# Altium project RetroClock-PCBMAIN.PrjPcb (part 2 of 2)
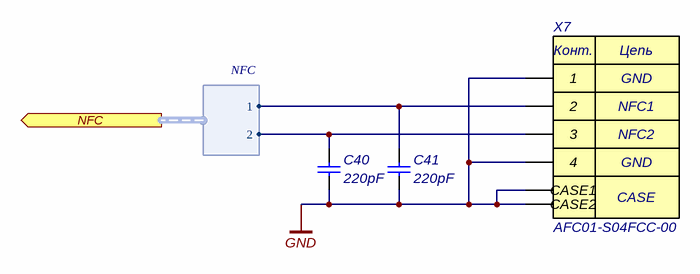
[diagram p9: RF-CON-NFC.SchDoc]

## Nets that join several sheets
GND: Board (42 pins), MCU (8 pins), I2C-LX (C27.1 C28.1 D3.3), I2C-RTC (6 pins), NIXIE-CTRL (31 pins), NIXIE-CTRL/EXPANDER (C25_NIXIE-CTRL_EXPANDER#1.1 C26_NIXIE-CTRL_EXPANDER#1.1 D2_NIXIE-CTRL_EXPANDER#1.9 D2_NIXIE-CTRL_EXPANDER#1.PAD), NIXIE-CTRL (31 pins), NIXIE-CTRL/EXPANDER (C25_NIXIE-CTRL_EXPANDER#2.1 C26_NIXIE-CTRL_EXPANDER#2.1 D2_NIXIE-CTRL_EXPANDER#2.9 D2_NIXIE-CTRL_EXPANDER#2.PAD), NIXIE-CTRL (31 pins), NIXIE-CTRL/EXPANDER (C25_NIXIE-CTRL_EXPANDER#3.1 C26_NIXIE-CTRL_EXPANDER#3.1 D2_NIXIE-CTRL_EXPANDER#3.9 D2_NIXIE-CTRL_EXPANDER#3.PAD), NIXIE-CTRL (31 pins), NIXIE-CTRL/EXPANDER (C25_NIXIE-CTRL_EXPANDER#4.1 C26_NIXIE-CTRL_EXPANDER#4.1 D2_NIXIE-CTRL_EXPANDER#4.9 D2_NIXIE-CTRL_EXPANDER#4.PAD), PWM-DCBOOST-NIXIE (10 pins), RF-PCBF-2G4 (C38.1 C39.1 W1.2), RF-CON-NFC (6 pins)
VDD-DIGITAL: Board (23 pins), I2C-LX (C27.2 C28.2 D3.1), NIXIE-CTRL (5 pins), NIXIE-CTRL/EXPANDER (C25_NIXIE-CTRL_EXPANDER#1.2 C26_NIXIE-CTRL_EXPANDER#1.2 D2_NIXIE-CTRL_EXPANDER#1.21 R27_NIXIE-CTRL_EXPANDER#1.2), NIXIE-CTRL (5 pins), NIXIE-CTRL/EXPANDER (C25_NIXIE-CTRL_EXPANDER#2.2 C26_NIXIE-CTRL_EXPANDER#2.2 D2_NIXIE-CTRL_EXPANDER#2.21 R27_NIXIE-CTRL_EXPANDER#2.2), NIXIE-CTRL (5 pins), NIXIE-CTRL/EXPANDER (C25_NIXIE-CTRL_EXPANDER#3.2 C26_NIXIE-CTRL_EXPANDER#3.2 D2_NIXIE-CTRL_EXPANDER#3.21 R27_NIXIE-CTRL_EXPANDER#3.2), NIXIE-CTRL (5 pins), NIXIE-CTRL/EXPANDER (C25_NIXIE-CTRL_EXPANDER#4.2 C26_NIXIE-CTRL_EXPANDER#4.2 D2_NIXIE-CTRL_EXPANDER#4.21 R27_NIXIE-CTRL_EXPANDER#4.2)
VDD-NIXIE: NIXIE-CTRL (R28_NIXIE-CTRL#1.1 VT1_NIXIE-CTRL#1.2), NIXIE-CTRL (R28_NIXIE-CTRL#2.1 VT1_NIXIE-CTRL#2.2), NIXIE-CTRL (R28_NIXIE-CTRL#3.1 VT1_NIXIE-CTRL#3.2), NIXIE-CTRL (R28_NIXIE-CTRL#4.1 VT1_NIXIE-CTRL#4.2), PWM-DCBOOST-NIXIE (C33.1 C34.1 R76.1 VD1.1)
VDD-RTC: Board (VD2.1 VD3.1), I2C-RTC (C29.1 C30.1 D4.12)
VDD-VBUS: Board (14 pins), PWM-DCBOOST-NIXIE (C35.1 C37.1 D5.4 L4.1)
A0: NIXIE-CTRL (R56_NIXIE-CTRL#1.1 R61_NIXIE-CTRL#1.2), NIXIE-CTRL/EXPANDER (D2_NIXIE-CTRL_EXPANDER#1.18)
A0: NIXIE-CTRL (R56_NIXIE-CTRL#2.1 R61_NIXIE-CTRL#2.2), NIXIE-CTRL/EXPANDER (D2_NIXIE-CTRL_EXPANDER#2.18)
A0: NIXIE-CTRL (R56_NIXIE-CTRL#3.1 R61_NIXIE-CTRL#3.2), NIXIE-CTRL/EXPANDER (D2_NIXIE-CTRL_EXPANDER#3.18)
A0: NIXIE-CTRL (R56_NIXIE-CTRL#4.1 R61_NIXIE-CTRL#4.2), NIXIE-CTRL/EXPANDER (D2_NIXIE-CTRL_EXPANDER#4.18)
A1: NIXIE-CTRL (R57_NIXIE-CTRL#1.1 R62_NIXIE-CTRL#1.2), NIXIE-CTRL/EXPANDER (D2_NIXIE-CTRL_EXPANDER#1.23)
A1: NIXIE-CTRL (R57_NIXIE-CTRL#2.1 R62_NIXIE-CTRL#2.2), NIXIE-CTRL/EXPANDER (D2_NIXIE-CTRL_EXPANDER#2.23)
A1: NIXIE-CTRL (R57_NIXIE-CTRL#3.1 R62_NIXIE-CTRL#3.2), NIXIE-CTRL/EXPANDER (D2_NIXIE-CTRL_EXPANDER#3.23)
A1: NIXIE-CTRL (R57_NIXIE-CTRL#4.1 R62_NIXIE-CTRL#4.2), NIXIE-CTRL/EXPANDER (D2_NIXIE-CTRL_EXPANDER#4.23)
A2: NIXIE-CTRL (R58_NIXIE-CTRL#1.1 R63_NIXIE-CTRL#1.2), NIXIE-CTRL/EXPANDER (D2_NIXIE-CTRL_EXPANDER#1.24)
A2: NIXIE-CTRL (R58_NIXIE-CTRL#2.1 R63_NIXIE-CTRL#2.2), NIXIE-CTRL/EXPANDER (D2_NIXIE-CTRL_EXPANDER#2.24)
A2: NIXIE-CTRL (R58_NIXIE-CTRL#3.1 R63_NIXIE-CTRL#3.2), NIXIE-CTRL/EXPANDER (D2_NIXIE-CTRL_EXPANDER#3.24)
A2: NIXIE-CTRL (R58_NIXIE-CTRL#4.1 R63_NIXIE-CTRL#4.2), NIXIE-CTRL/EXPANDER (D2_NIXIE-CTRL_EXPANDER#4.24)
BRD-I2C-SCL: Board (7 pins), I2C-LX (D3.4), I2C-RTC (D4.10), NIXIE-CTRL/EXPANDER (D2_NIXIE-CTRL_EXPANDER#1.19), NIXIE-CTRL/EXPANDER (D2_NIXIE-CTRL_EXPANDER#2.19), NIXIE-CTRL/EXPANDER (D2_NIXIE-CTRL_EXPANDER#3.19), NIXIE-CTRL/EXPANDER (D2_NIXIE-CTRL_EXPANDER#4.19)
BRD-I2C-SDA: Board (7 pins), I2C-LX (D3.6), I2C-RTC (D4.9), NIXIE-CTRL/EXPANDER (D2_NIXIE-CTRL_EXPANDER#1.20), NIXIE-CTRL/EXPANDER (D2_NIXIE-CTRL_EXPANDER#2.20), NIXIE-CTRL/EXPANDER (D2_NIXIE-CTRL_EXPANDER#3.20), NIXIE-CTRL/EXPANDER (D2_NIXIE-CTRL_EXPANDER#4.20)
BRD-NIXIE-INT#: Board (R1.2), NIXIE-CTRL/EXPANDER (D2_NIXIE-CTRL_EXPANDER#1.22 R27_NIXIE-CTRL_EXPANDER#1.1), NIXIE-CTRL/EXPANDER (D2_NIXIE-CTRL_EXPANDER#2.22 R27_NIXIE-CTRL_EXPANDER#2.1), NIXIE-CTRL/EXPANDER (D2_NIXIE-CTRL_EXPANDER#3.22 R27_NIXIE-CTRL_EXPANDER#3.1), NIXIE-CTRL/EXPANDER (D2_NIXIE-CTRL_EXPANDER#4.22 R27_NIXIE-CTRL_EXPANDER#4.1)
P00: NIXIE-CTRL (R54_NIXIE-CTRL#1.1), NIXIE-CTRL/EXPANDER (D2_NIXIE-CTRL_EXPANDER#1.1)
P00: NIXIE-CTRL (R54_NIXIE-CTRL#2.1), NIXIE-CTRL/EXPANDER (D2_NIXIE-CTRL_EXPANDER#2.1)
P00: NIXIE-CTRL (R54_NIXIE-CTRL#3.1), NIXIE-CTRL/EXPANDER (D2_NIXIE-CTRL_EXPANDER#3.1)
P00: NIXIE-CTRL (R54_NIXIE-CTRL#4.1), NIXIE-CTRL/EXPANDER (D2_NIXIE-CTRL_EXPANDER#4.1)
P01: NIXIE-CTRL (R55_NIXIE-CTRL#1.1), NIXIE-CTRL/EXPANDER (D2_NIXIE-CTRL_EXPANDER#1.2)
P01: NIXIE-CTRL (R55_NIXIE-CTRL#2.1), NIXIE-CTRL/EXPANDER (D2_NIXIE-CTRL_EXPANDER#2.2)
P01: NIXIE-CTRL (R55_NIXIE-CTRL#3.1), NIXIE-CTRL/EXPANDER (D2_NIXIE-CTRL_EXPANDER#3.2)
P01: NIXIE-CTRL (R55_NIXIE-CTRL#4.1), NIXIE-CTRL/EXPANDER (D2_NIXIE-CTRL_EXPANDER#4.2)
P03: NIXIE-CTRL (R53_NIXIE-CTRL#1.1), NIXIE-CTRL/EXPANDER (D2_NIXIE-CTRL_EXPANDER#1.4)
P03: NIXIE-CTRL (R53_NIXIE-CTRL#2.1), NIXIE-CTRL/EXPANDER (D2_NIXIE-CTRL_EXPANDER#2.4)
P03: NIXIE-CTRL (R53_NIXIE-CTRL#3.1), NIXIE-CTRL/EXPANDER (D2_NIXIE-CTRL_EXPANDER#3.4)
P03: NIXIE-CTRL (R53_NIXIE-CTRL#4.1), NIXIE-CTRL/EXPANDER (D2_NIXIE-CTRL_EXPANDER#4.4)
P04: NIXIE-CTRL (R52_NIXIE-CTRL#1.1), NIXIE-CTRL/EXPANDER (D2_NIXIE-CTRL_EXPANDER#1.5)
P04: NIXIE-CTRL (R52_NIXIE-CTRL#2.1), NIXIE-CTRL/EXPANDER (D2_NIXIE-CTRL_EXPANDER#2.5)
P04: NIXIE-CTRL (R52_NIXIE-CTRL#3.1), NIXIE-CTRL/EXPANDER (D2_NIXIE-CTRL_EXPANDER#3.5)
P04: NIXIE-CTRL (R52_NIXIE-CTRL#4.1), NIXIE-CTRL/EXPANDER (D2_NIXIE-CTRL_EXPANDER#4.5)
P05: NIXIE-CTRL (R51_NIXIE-CTRL#1.1), NIXIE-CTRL/EXPANDER (D2_NIXIE-CTRL_EXPANDER#1.6)
P05: NIXIE-CTRL (R51_NIXIE-CTRL#2.1), NIXIE-CTRL/EXPANDER (D2_NIXIE-CTRL_EXPANDER#2.6)
P05: NIXIE-CTRL (R51_NIXIE-CTRL#3.1), NIXIE-CTRL/EXPANDER (D2_NIXIE-CTRL_EXPANDER#3.6)
P05: NIXIE-CTRL (R51_NIXIE-CTRL#4.1), NIXIE-CTRL/EXPANDER (D2_NIXIE-CTRL_EXPANDER#4.6)
P06: NIXIE-CTRL (R59_NIXIE-CTRL#1.1), NIXIE-CTRL/EXPANDER (D2_NIXIE-CTRL_EXPANDER#1.7)
P06: NIXIE-CTRL (R59_NIXIE-CTRL#2.1), NIXIE-CTRL/EXPANDER (D2_NIXIE-CTRL_EXPANDER#2.7)
P06: NIXIE-CTRL (R59_NIXIE-CTRL#3.1), NIXIE-CTRL/EXPANDER (D2_NIXIE-CTRL_EXPANDER#3.7)
P06: NIXIE-CTRL (R59_NIXIE-CTRL#4.1), NIXIE-CTRL/EXPANDER (D2_NIXIE-CTRL_EXPANDER#4.7)
P10: NIXIE-CTRL (R50_NIXIE-CTRL#1.1), NIXIE-CTRL/EXPANDER (D2_NIXIE-CTRL_EXPANDER#1.10)
P10: NIXIE-CTRL (R50_NIXIE-CTRL#2.1), NIXIE-CTRL/EXPANDER (D2_NIXIE-CTRL_EXPANDER#2.10)
P10: NIXIE-CTRL (R50_NIXIE-CTRL#3.1), NIXIE-CTRL/EXPANDER (D2_NIXIE-CTRL_EXPANDER#3.10)
P10: NIXIE-CTRL (R50_NIXIE-CTRL#4.1), NIXIE-CTRL/EXPANDER (D2_NIXIE-CTRL_EXPANDER#4.10)
P12: NIXIE-CTRL (R60_NIXIE-CTRL#1.1), NIXIE-CTRL/EXPANDER (D2_NIXIE-CTRL_EXPANDER#1.12)
P12: NIXIE-CTRL (R60_NIXIE-CTRL#2.1), NIXIE-CTRL/EXPANDER (D2_NIXIE-CTRL_EXPANDER#2.12)
P12: NIXIE-CTRL (R60_NIXIE-CTRL#3.1), NIXIE-CTRL/EXPANDER (D2_NIXIE-CTRL_EXPANDER#3.12)
P12: NIXIE-CTRL (R60_NIXIE-CTRL#4.1), NIXIE-CTRL/EXPANDER (D2_NIXIE-CTRL_EXPANDER#4.12)
P13: NIXIE-CTRL (R49_NIXIE-CTRL#1.1), NIXIE-CTRL/EXPANDER (D2_NIXIE-CTRL_EXPANDER#1.13)
P13: NIXIE-CTRL (R49_NIXIE-CTRL#2.1), NIXIE-CTRL/EXPANDER (D2_NIXIE-CTRL_EXPANDER#2.13)
P13: NIXIE-CTRL (R49_NIXIE-CTRL#3.1), NIXIE-CTRL/EXPANDER (D2_NIXIE-CTRL_EXPANDER#3.13)
P13: NIXIE-CTRL (R49_NIXIE-CTRL#4.1), NIXIE-CTRL/EXPANDER (D2_NIXIE-CTRL_EXPANDER#4.13)
P14: NIXIE-CTRL (R48_NIXIE-CTRL#1.1), NIXIE-CTRL/EXPANDER (D2_NIXIE-CTRL_EXPANDER#1.14)
P14: NIXIE-CTRL (R48_NIXIE-CTRL#2.1), NIXIE-CTRL/EXPANDER (D2_NIXIE-CTRL_EXPANDER#2.14)
P14: NIXIE-CTRL (R48_NIXIE-CTRL#3.1), NIXIE-CTRL/EXPANDER (D2_NIXIE-CTRL_EXPANDER#3.14)
P14: NIXIE-CTRL (R48_NIXIE-CTRL#4.1), NIXIE-CTRL/EXPANDER (D2_NIXIE-CTRL_EXPANDER#4.14)
P16: NIXIE-CTRL (R64_NIXIE-CTRL#1.1), NIXIE-CTRL/EXPANDER (D2_NIXIE-CTRL_EXPANDER#1.16)
P16: NIXIE-CTRL (R64_NIXIE-CTRL#2.1), NIXIE-CTRL/EXPANDER (D2_NIXIE-CTRL_EXPANDER#2.16)
P16: NIXIE-CTRL (R64_NIXIE-CTRL#3.1), NIXIE-CTRL/EXPANDER (D2_NIXIE-CTRL_EXPANDER#3.16)
P16: NIXIE-CTRL (R64_NIXIE-CTRL#4.1), NIXIE-CTRL/EXPANDER (D2_NIXIE-CTRL_EXPANDER#4.16)

## Assembly variants
Debug: not fitted C46 C47 R59 R60 R66 R108 R112 R114 R155 R161 R162 R213 R214 R215 R?_NIXIE-CTRL1 R?_NIXIE-CTRL1 R?_NIXIE-CTRL1 R?_NIXIE-CTRL2 R?_NIXIE-CTRL2 R?_NIXIE-CTRL2 R?_NIXIE-CTRL3 R?_NIXIE-CTRL3 R?_NIXIE-CTRL3